# EAGLE design Super-Regenerative-FM-Tuner-ForcedQuench (EAGLE 7.2.0)
Forced quenching improves three-transistor FM tuner Lyle Williams -February 29, 2016 http://www.edn.com/design/diy/4441531/Forced-quenching-improves-three-transistor-FM-tuner
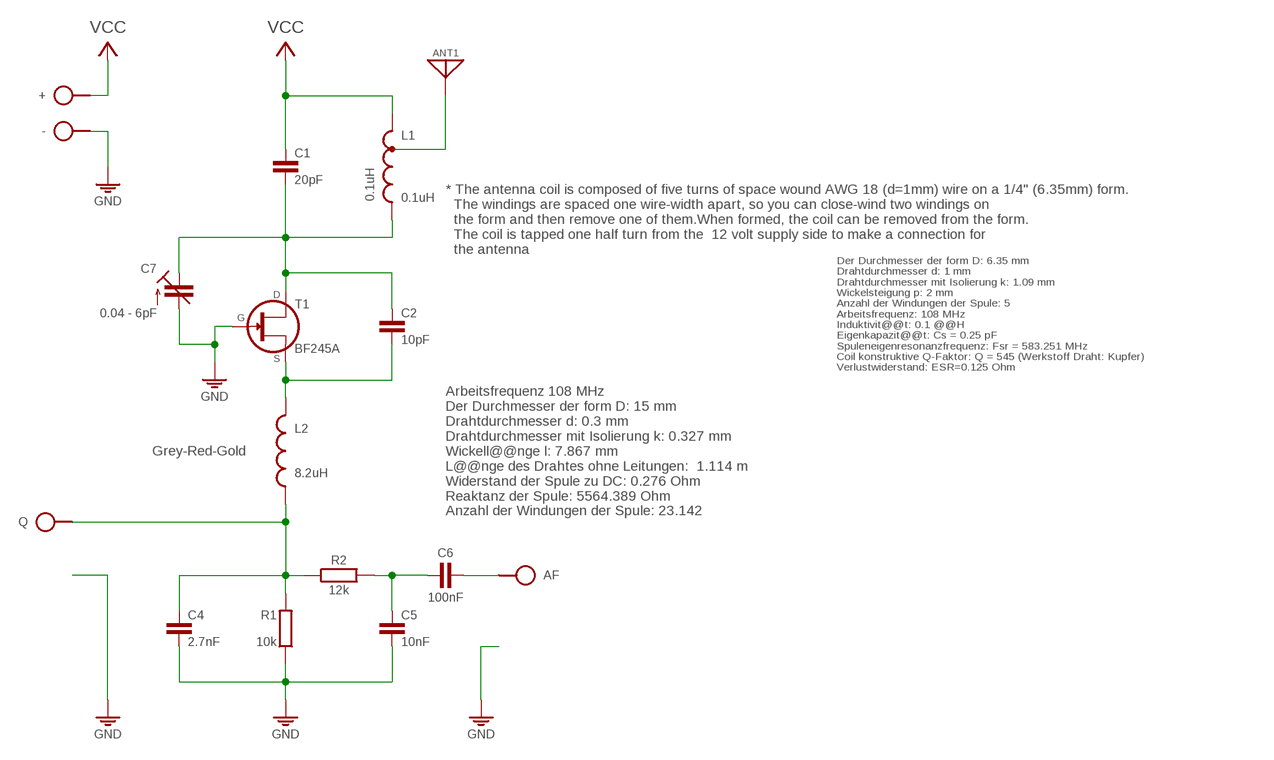
[diagram p0: schematic, sheet 1]

## Parts
+  SPAD  [SPAD]
-  SPAD  [SPAD]
AF  SPAD  [SPAD]
ANT1  ANT  [SPAD]
C1  20pF  C025-015X024  [C025-015X024]
C2  10pF  C025-015X024  [C025-015X024]
C4  2.7nF  C050-020X044  [C050-020X044]
C5  10nF  C025-015X024  [C025-015X024]
C6  100nF  C-H050-020X044  [C050-020X044]
C7  0.04 - 6pF  C-TR-PH20127-TZ03  [CTRIMTZ03]
L1  0.1uH  L-TAP1L-08-7/5H  [L-08-7/8-TAP1]
L2  8.2uH  L04/7-V  [L-04/7-V]
Q  SPAD  [SPAD]
R1  10k  R0204/7  [0204/7]
R2  12k  R-H0204/7  [0204/7]
T1  BF245A  BF245BTO92  [TO92-GSD]

## Nets
GND: -.1 C4.2 C5.2 C7.1(A) R1.1 T1.1(G)
N$1: C1.2 C2.1 C7.2(E) L1.2 T1.3(D)
N$2: C4.1 L2.2 Q.1 R1.2 R2.1
N$4: ANT1.1 L1.3(T)
N$5: C2.2 L2.1 T1.2(S)
N$6: C5.1 C6.1 R2.2
N$8: AF.1 C6.2
VCC: +.1 C1.1 L1.1

## Notes on the sheet
- * The antenna coil is composed of five turns of space wound AWG 18 (d=1mm) wire on a 1/4" (6.35mm) form.
    The windings are spaced one wire-width apart, so you can close-wind two windings on
    the form and then remove one of them.When formed, the coil can be removed from the form.
    The coil is tapped one half turn from the  12 volt supply side to make a connection for
    the antenna
- Der Durchmesser der form D: 6.35 mm
  Drahtdurchmesser d: 1 mm
  Drahtdurchmesser mit Isolierung k: 1.09 mm
  Wickelsteigung p: 2 mm
  Anzahl der Windungen der Spule: 5
  Arbeitsfrequenz: 108 MHz
  Induktivit@@t: 0.1 @@H
  Eigenkapazit@@t: Cs = 0.25 pF
  Spuleneigenresonanzfrequenz: Fsr = 583.251 MHz
  Coil konstruktive Q-Faktor: Q = 545 (Werkstoff Draht: Kupfer)
  Verlustwiderstand: ESR=0.125 Ohm
- Grey-Red-Gold
- Arbeitsfrequenz 108 MHz
  Der Durchmesser der form D: 15 mm
  Drahtdurchmesser d: 0.3 mm
  Drahtdurchmesser mit Isolierung k: 0.327 mm
  Wickell@@nge l: 7.867 mm
  L@@nge des Drahtes ohne Leitungen:  1.114 m
  Widerstand der Spule zu DC: 0.276 Ohm
  Reaktanz der Spule: 5564.389 Ohm
  Anzahl der Windungen der Spule: 23.142

## Library data of the parts
+ - AF Q = pad:SPAD
ANT1 = pad:ANT
C1 C2 C4 C5 = c:C: CAPACITOR, European symbol
C6 = c:C-H
C7 = cap-trim:C-TR-PH20127
L1 = l:L-TAP1
L2 = l:L: Potentiometers Beckman, Copal, Piher, Spectrol, Schukat Created by librarian@cadsoft.de
R1 = r:R: RESISTOR, European symbol
R2 = r:R-H
T1 = t:BF245B: Transistors

## Net classes
0 default: width 0.61 mm

## Board
Forced quenching improves three-transistor FM tuner Lyle Williams -February 29, 2016 http://www.edn.com/design/diy/4441531/Forced-quenching-improves-three-transistor-FM-tuner
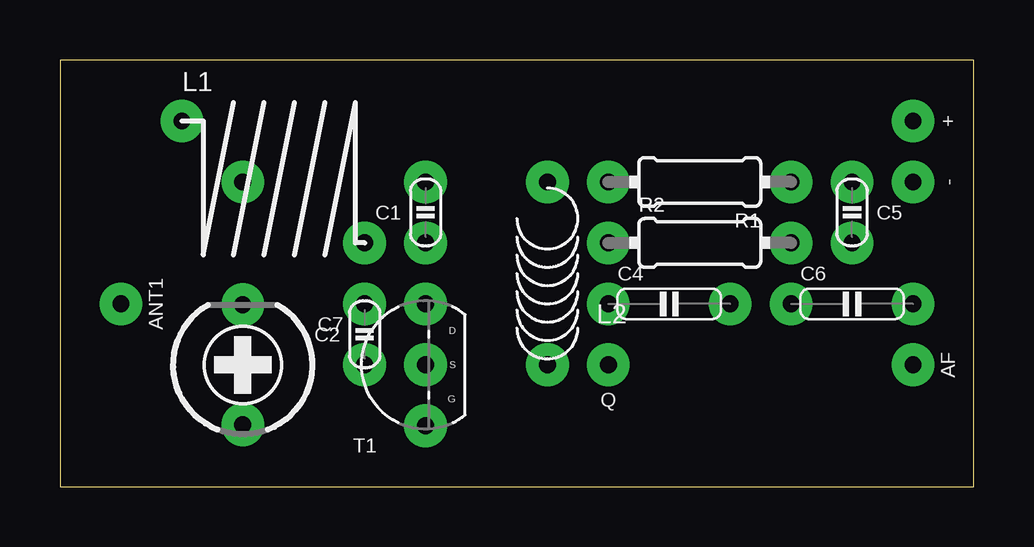
[diagram p1: board, top side]
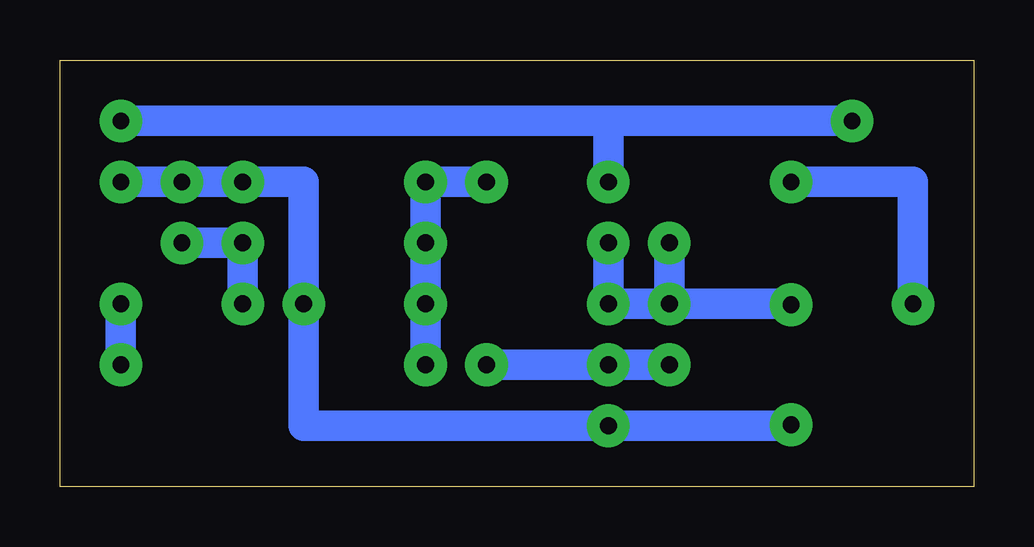
[diagram p2: board, bottom side, seen from below]

Size 38.1 x 17.78 mm. Coordinates in mm from the lower left corner, seen from the top.
Outline: 38.1,17.78 0,17.78 0,0 38.1,0 38.1,17.78
Copper layers (1*16): Top 0.035mm / dielectric 1.5mm / Bottom 0.035mm
Design rules "default": minimum track width 10mil, minimum drill 24mil, track to track 8mil, track to pad 8mil, pad to pad 8mil, via to via 8mil, smd to smd 8mil, copper to edge 40mil, drill to drill 8mil, minimum pad ring 10mil, minimum via ring 8mil, stop-mask expansion 4mil, vias tented up to drill 0mil, thermal gap 10mil

### Footprints (pad centres in the part's own frame; a part is rotated, then mirrored left to right if it is on the bottom)
SPAD = drill 0.7 pad 1.778: 1 0,0
C025-015X024 = drill 0.7 pad 1.778: 1 0,1.27; 2 0,-1.27
C050-020X044 = drill 0.7 pad 1.778: 1 -2.54,0; 2 2.54,0
CTRIMTZ03 = drill 0.7 pad 1.778: 1 0,2.5; 2 0,-2.5
L-08-7/8-TAP1 = drill 0.7 pad 1.778: 1 -2.54,2.54; 2 5.08,-2.54; 3 0,0
L-04/7-V = drill 0.7 pad 1.778: 1 0,3.81; 2 0,-3.81
0204/7 = drill 0.7 pad 1.778: 1 -3.81,0; 2 3.81,0
TO92-GSD = drill 0.7 pad 1.778: 1 0,2.54; 2 0,0; 3 0,-2.54

### Placement (x,y rotation side)
+  35.56,15.24 180 top
-  35.56,12.7 180 top
AF  35.56,5.08 180 top
ANT1  2.54,7.62 180 top
C1  15.24,11.43 0 top
C2  12.7,6.35 0 top
C4  25.4,7.62 0 top
C5  33.02,11.43 180 top
C6  33.02,7.62 0 top
C7  7.62,5.08 180 top
L1  0.1μH  [L-08-7/8-TAP1]  7.62,12.7 0 top
L2  8.2μH  [L-04/7-V]  20.32,8.89 180 top
Q  22.86,5.08 90 top
R1  10kΩ  [0204/7]  26.67,12.7 180 top
R2  12kΩ  [0204/7]  26.67,10.16 0 top
T1  15.24,5.08 180 top

### Tracks (layer width: path | path; a pad name or v marks a point on that pad's centre or on a via)
GND
  Bottom 1.27: -.1 C5.2 R1.1 27.94,12.7 C4.2 27.94,2.54 T1.1 7.62,2.54 | 7.62,2.54
N$1
  Bottom 1.27: 7.62,7.62 | C1.2 T1.3 C2.1 | L1.2 C2.1 | C2.1 7.62,7.62
N$2
  Bottom 1.27: Q.1 C4.1 R2.1 R1.2 L2.2
N$4
  Bottom 1.27: ANT1.1 2.54,12.7 L1.3
N$5
  Bottom 1.27: T1.2 L2.1 C2.2
N$6
  Bottom 1.27: C6.1 R2.2 C5.1
N$8
  Bottom 1.27: AF.1 C6.2
VCC
  Bottom 1.27: L1.1 15.24,15.24 | C1.1 15.24,15.24 | 15.24,15.24 +.1